# EasyEDA schematic 典型微控制系统设计开发.json
TITLE: 开发平台张三20002000; REV: 1.0; Date: 2022-08-24; Sheet: 1/1; Company: Your Company
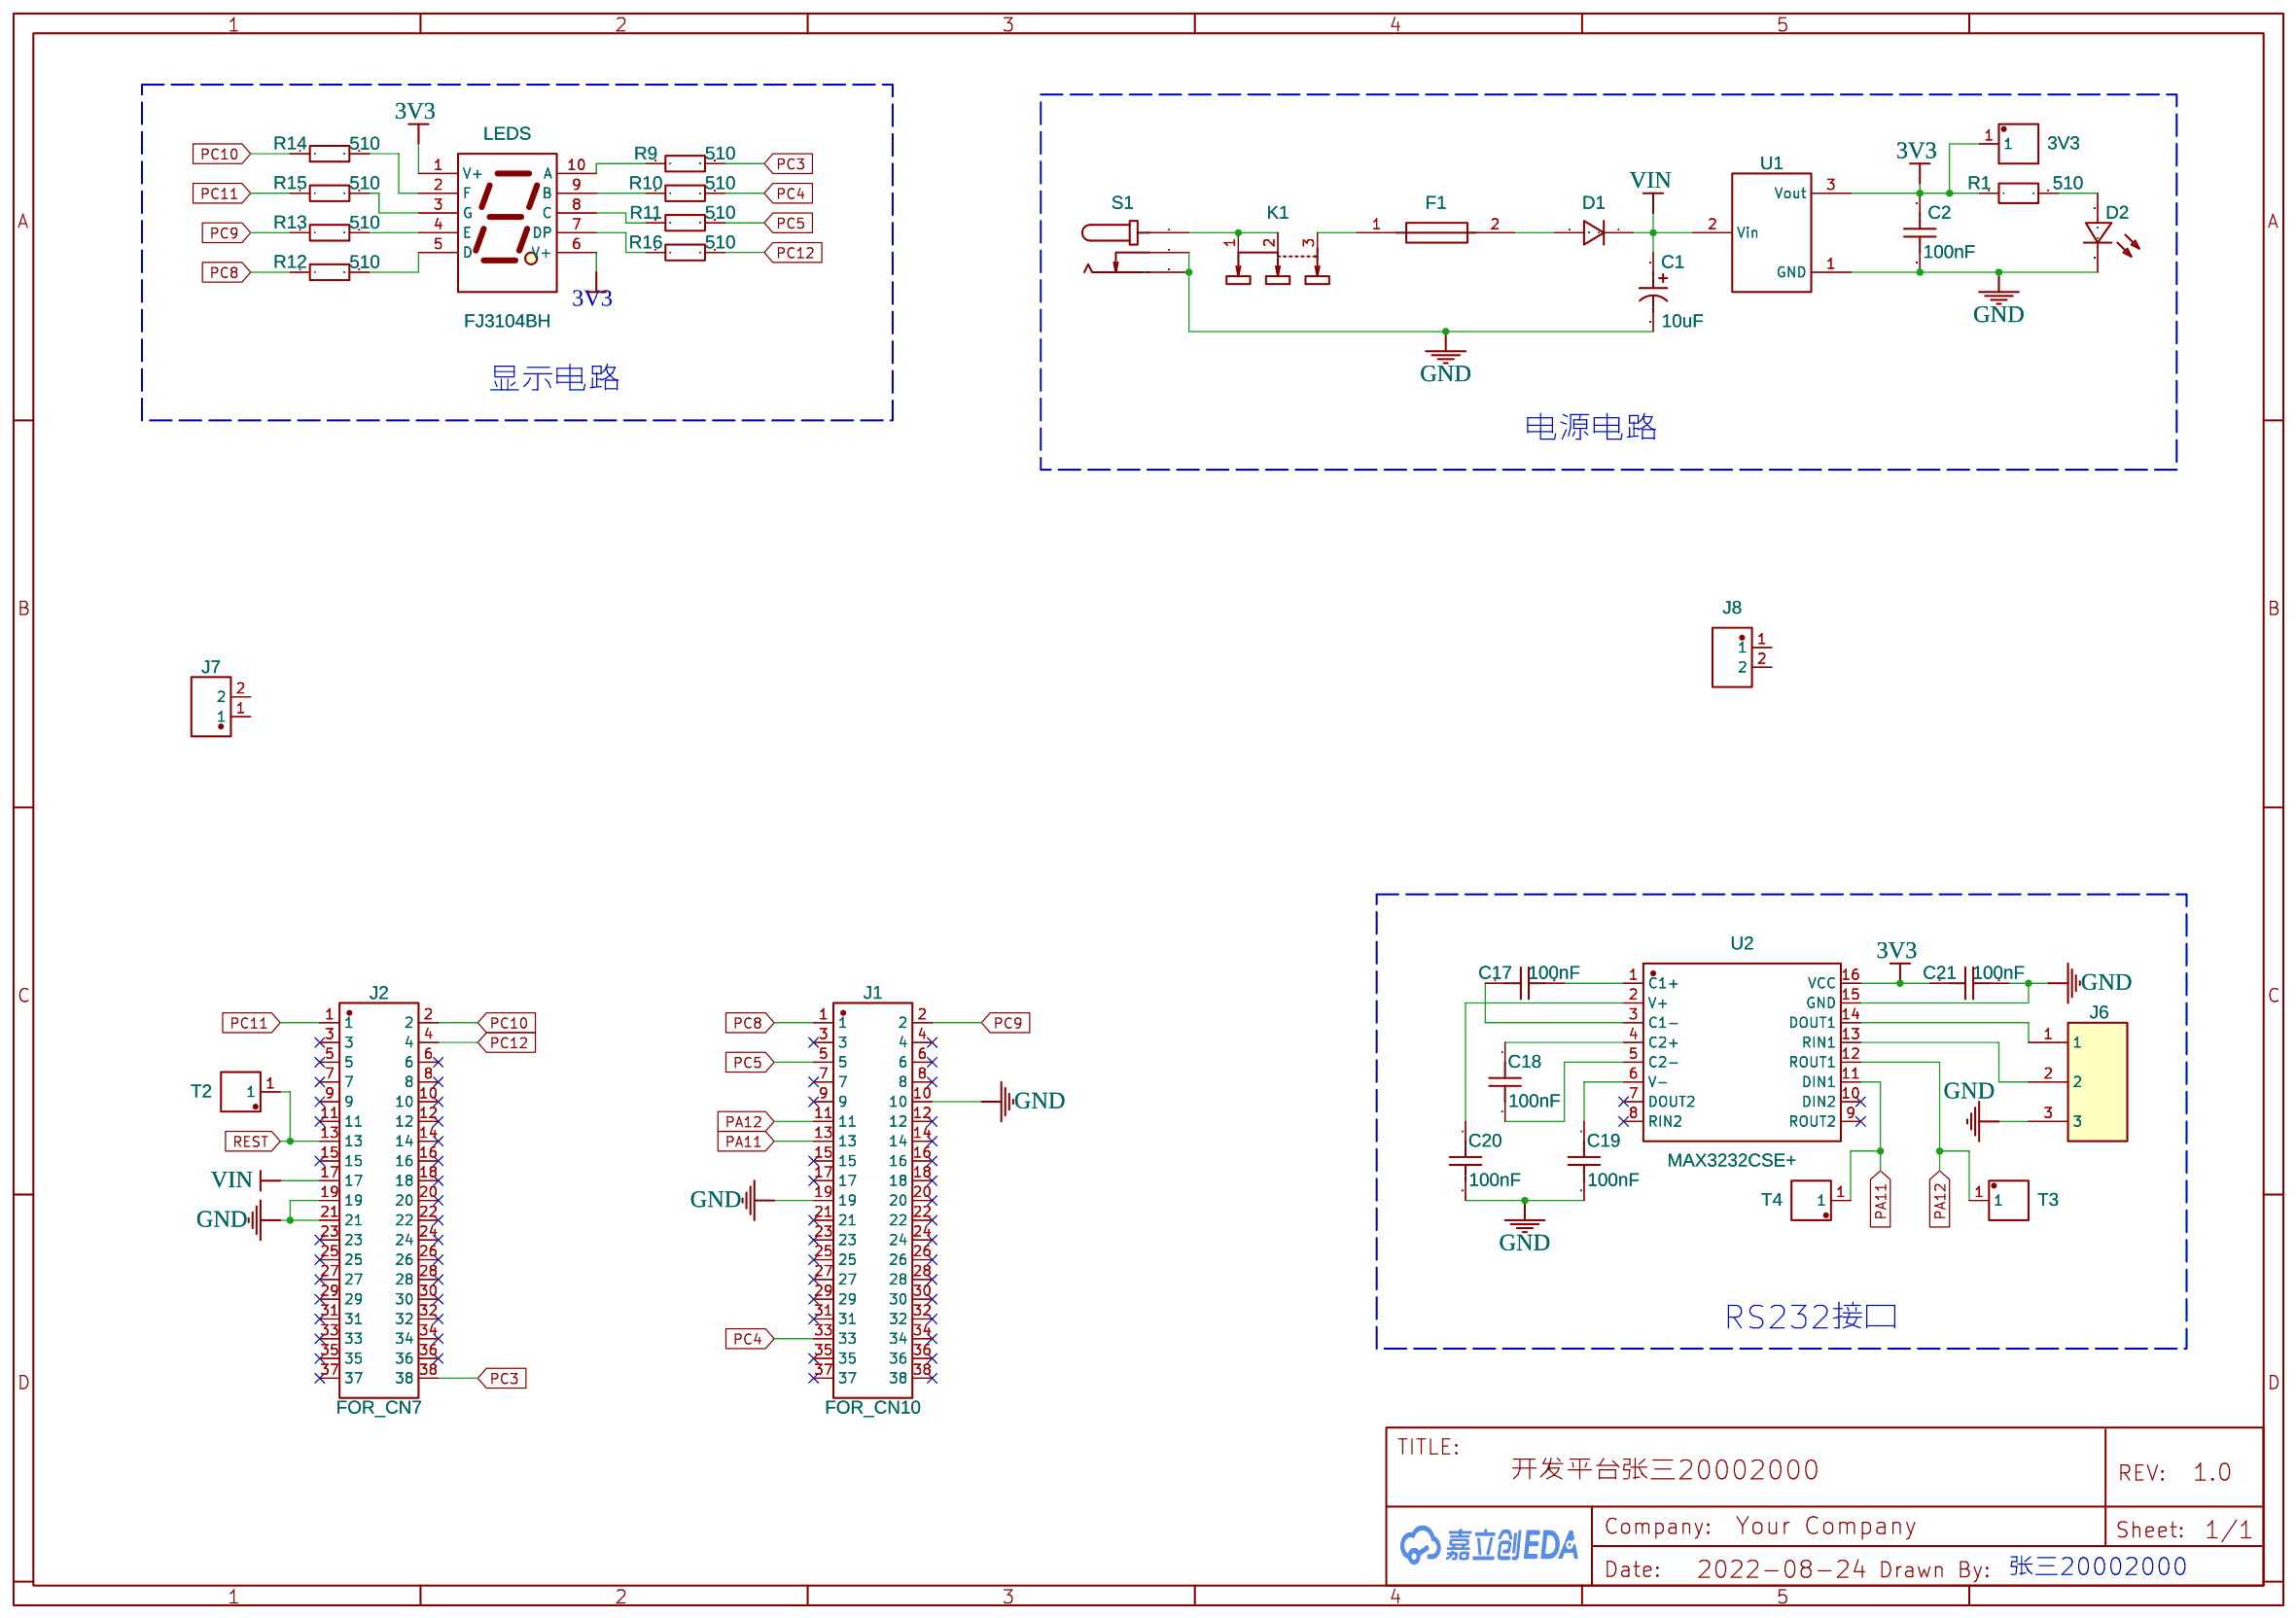
[diagram p0: schematic sheet]

## Parts
3V3  54101-T06-00  [HDR-TH_1P-P2.54-V-M]
C1  10uF  [CAP-TH_BD5.0-P2.00-D0.6-FD]
C2  100nF  [CAP-TH_L5.5-W2.5-P5.00-D1.0]
C17  100nF  [CAP-TH_L5.5-W2.5-P5.00-D1.0]
C18  100nF  [CAP-TH_L5.5-W2.5-P5.00-D1.0]
C19  100nF  [CAP-TH_L5.5-W2.5-P5.00-D1.0]
C20  100nF  [CAP-TH_L5.5-W2.5-P5.00-D1.0]
C21  100nF  [CAP-TH_L5.5-W2.5-P5.00-D1.0]
D1  1N5817_C169165  [DO-41_BD2.4-L4.7-P8.70-D0.9-RD]
D2  TJ-L3FYTGHTFCLFLC2R-A5  [LED-TH_BD3.9-P2.54-FD]
F1  A72-065  [FUSE-TH_L9.7-W3.1-P5.10-D0.6-S1.50]
J1  FOR_CN10  [HDR-TH_38P-P2.54-V-F-R2-C19-S2.54]
J2  FOR_CN7  [HDR-TH_38P-P2.54-V-F-R2-C19-S2.54]
J6  WJ124-3.81-3P  [CONN-TH_3P-P3.81_WJ124-3.81-3P]
J7  WJ124-3.81-2P  [CONN-TH_2P-P3.81_KF124-3.81-2P]
J8  WJ124-3.81-2P  [CONN-TH_2P-P3.81_KF124-3.81-2P]
K1  SS-12D10L5  [SW-TH_SS-12D10L5]
LEDS  FJ3104BH  [LED-SEG-TH_10P-L12.7-W7.6-P2.54-LS5.08-TL]
R1  510  [RES-TH_BD1.8-L3.2-P7.20-D0.4]
R9  510  [RES-TH_BD1.8-L3.2-P7.20-D0.4]
R10  510  [RES-TH_BD1.8-L3.2-P7.20-D0.4]
R11  510  [RES-TH_BD1.8-L3.2-P7.20-D0.4]
R12  510  [RES-TH_BD1.8-L3.2-P7.20-D0.4]
R13  510  [RES-TH_BD1.8-L3.2-P7.20-D0.4]
R14  510  [RES-TH_BD1.8-L3.2-P7.20-D0.4]
R15  510  [RES-TH_BD1.8-L3.2-P7.20-D0.4]
R16  510  [RES-TH_BD1.8-L3.2-P7.20-D0.4]
S1  JPD1030-N521-4F  [DC-IN-TH_JPD1030-N521-4F]
T2  54101-T06-00  [HDR-TH_1P-P2.54-V-M]
T3  54101-T06-00  [HDR-TH_1P-P2.54-V-M]
T4  54101-T06-00  [HDR-TH_1P-P2.54-V-M]
U1  HT7533-1_C32617  [TO-92-3_L4.9-W3.7-P1.27-L]
U2  MAX3232CSE+  [SO-16_L10.0-W4.0-P1.27-LS6.2-BL]

## Library data of the parts
3V3 T2-T4 = 54101-T06-00: Supplier: LCSC; Supplier Part: C213463; Manufacturer: Amphenol ICC; Contributor: LCSC; JLCPCB Part Class: Extended Part
C1 = 50V10UF CD110: Supplier: LCSC; Supplier Part: C2960200; Manufacturer: HRK(鸿瑞凯电子); Manufacturer Part: 50V10uF CD110; JLCPCB Part Class: Extended Part; Contributor: lcsc
C2 C17-C21 = CT4-0805B104K500F3: Supplier: LCSC; Manufacturer: FH; Contributor: LCSC; Supplier Part: C84772; JLCPCB Part Class: Extended Part
D1 = 1N5817_C169165: Supplier Part: C169165; Supplier: LCSC; Manufacturer: DIOFIT; Manufacturer Part: 1N5817; Contributor: LCSC; JLCPCB Part Class: Extended Part
D2 = TJ-L3FYTGHTFCLFLC2R-A5: Supplier: LCSC; Supplier Part: C330746; Manufacturer: TOGIALED; Contributor: LCSC; JLCPCB Part Class: Extended Part
F1 = A72-065: Supplier: LCSC; Manufacturer: JDTFUSE; Contributor: LCSC; Supplier Part: C135426; JLCPCB Part Class: Extended Part
J1 J2 = PM254-2-19-Z-8.5: Supplier: LCSC; Supplier Part: C2897420; Manufacturer: HCTL(华灿天禄); Contributor: LCSC; JLCPCB Part Class: Extended Part
J6 = WJ124-3.81-3P: Supplier: LCSC; Manufacturer: ReliaPro; Supplier Part: C36780; JLCPCB Part Class: Extended Part
J7 J8 = WJ124-3.81-2P: Supplier: LCSC; Manufacturer: ReliaPro; Supplier Part: C69811; JLCPCB Part Class: Extended Part
K1 = SS-12D10L5: Supplier: LCSC; Supplier Part: C319012; Manufacturer: XKB Enterprise; Contributor: LCSC; JLCPCB Part Class: Extended Part
LEDS = FJ3104BH: Supplier: LCSC; Supplier Part: C2938319; Manufacturer: 志浩; Contributor: LCSC
R1 = MF1/8W-10KΩ±1%T52: Supplier: LCSC; Supplier Part: C713919; Manufacturer: Huaxing Mechanical-Elec.; Contributor: LCSC; JLCPCB Part Class: Extended Part; Resistance: 10kΩ
R9-R16 = MF1/8W-43Ω±1% T52: Supplier: LCSC; Supplier Part: C119149; Manufacturer: Chian Chia Elec; Contributor: LCSC; JLCPCB Part Class: Extended Part; Resistance: 43Ω
S1 = JPD1030-N521-4F: Supplier: LCSC; Supplier Part: C426213; Manufacturer: FOXCONN(富士康); Contributor: LCSC; JLCPCB Part Class: Extended Part
U1 = HT7533-1_C32617: Supplier: LCSC; Manufacturer: HOLTEK; Manufacturer Part: HT7533-1; Supplier Part: C32617; JLCPCB Part Class: Extended Part
U2 = MAX3232CSE+: Supplier: LCSC; Supplier Part: C143430; Manufacturer: Maxim Integrated; Contributor: LCSC; JLCPCB Part Class: Extended Part

## Nets
3V3: 3V3.1 C2.1 C21.1 LEDS.1(V+) LEDS.6(V+) R1.1 U1.3(Vout) U2.16(VCC)
GND: C1.2 C2.2 C19.2 C20.2 C21.2 D2.2 J1.10 J1.19 J2.19 J2.21 J6.3 S1.2 S1.3 U1.1(GND) U2.15(GND)
VIN: C1.1 D1.1 J2.17 U1.2(Vin)
PA11: J1.13 T4.1 U2.11(DIN1)
PA12: J1.11 T3.1 U2.12(ROUT1)
PC3: J2.38 R9.2
PC4: J1.33 R10.2
PC5: J1.5 R11.2
PC8: J1.1 R12.1
PC9: J1.2 R13.1
PC10: J2.2 R14.1
PC11: J2.1 R15.1
PC12: J2.4 R16.2
REST: J2.13 T2.1
Net-(C17-1): C17.1 U2.3(C1-)
Net-(C17-2): C17.2 U2.1(C1+)
Net-(C18-1): C18.1 U2.4(C2+)
Net-(C18-2): C18.2 U2.5(C2-)
Net-(C19-1): C19.1 U2.6(V-)
Net-(C20-1): C20.1 U2.2(V+)
Net-(D1-2): D1.2 F1.2
Net-(D2-1): D2.1 R1.2
Net-(F1-1): F1.1 K1.3
Net-(J6-1): J6.1 U2.14(DOUT1)
Net-(J6-2): J6.2 U2.13(RIN1)
Net-(K1-1): K1.1 K1.2 S1.1
Net-(LEDS-2): LEDS.2(F) R14.2
Net-(LEDS-3): LEDS.3(G) R15.2
Net-(LEDS-4): LEDS.4(E) R13.2
Net-(LEDS-5): LEDS.5(D) R12.2
Net-(LEDS-7): LEDS.7(DP) R16.1
Net-(LEDS-8): LEDS.8(C) R11.1
Net-(LEDS-9): LEDS.9(B) R10.1
Net-(LEDS-10): LEDS.10(A) R9.1

Not connected (* = marked no-connect by the designer): J1 3* 4* 6* 7* 8* 9* 12* 14* 15* 16* 17* 18* 20* 21* 22* 23* 24* 25* 26* 27* 28* 29* 30* 31* 32* 34* 35* 36* 37* 38*; J2 3* 5* 6* 7* 8* 9* 10* 11* 12* 14* 15* 16* 18* 20* 22* 23* 24* 25* 26* 27* 28* 29* 30* 31* 32* 33* 34* 35* 36* 37*; J7 1 2; J8 1 2; U2 7(DOUT2)* 8(RIN2)* 9(ROUT2)* 10(DIN2)*

## Notes on the sheet
- 显示电路
- 电源电路
- RS232接口
- 张三20002000
